# Altium schematic sheet INA219 sensor.SchDoc
size A
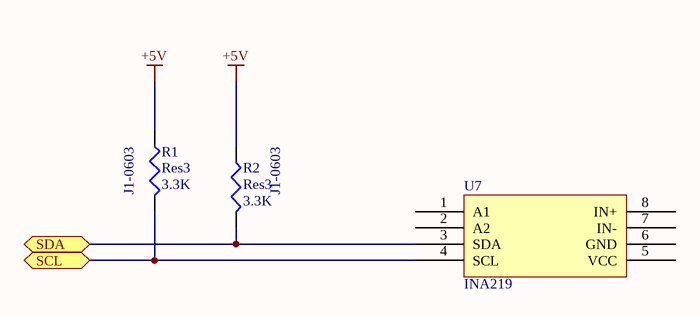
[diagram p0: INA219 sensor.SchDoc]

## Parts
R1  Res3  value 3.3K  [J1-0603]
R2  Res3  value 3.3K  [J1-0603]
U7  INA219  [INA219]

## Ports
SCL, SDA

## Nets
+5V: R1.1 R2.1
SCL: R1.2 U7.4(SCL) ; port SCL
SDA: R2.2 U7.3(SDA) ; port SDA

Not connected (* = marked no-connect by the designer): U7 1(A1) 2(A2) 5(VCC) 6(GND) 7(IN-) 8(IN+)

## Library data of the parts
R1 R2 = Res3: Resistor; Published: 8-Jun-2000; LatestRevisionDate: 29-May-2009; LatestRevisionNote: IPC-7351 Footprint Added.; PackageReference: J1-0603; Publisher: Altium Limited; PackageDescription: Chip Resistor